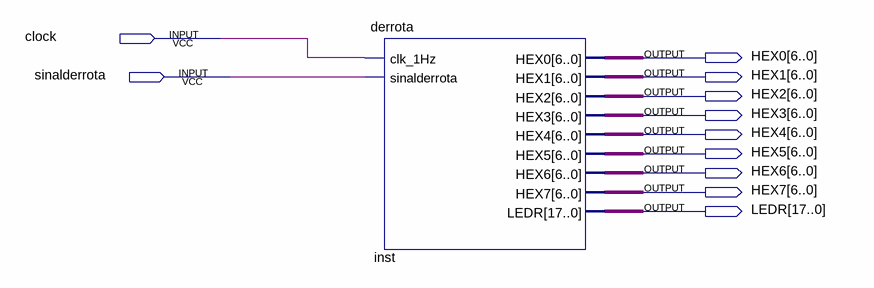
[diagram p0: schematic sheet]
// Quartus schematic esquematicotestederrota.bdf as structural Verilog: 1 symbols, 11 pins
module esquematicotestederrota (
  input  clock,
  input  sinalderrota,
  output [6:0] HEX0,
  output [6:0] HEX1,
  output [6:0] HEX2,
  output [6:0] HEX3,
  output [6:0] HEX4,
  output [6:0] HEX5,
  output [6:0] HEX6,
  output [6:0] HEX7,
  output [17:0] LEDR
);

  derrota inst (
    .clk_1Hz(clock), .sinalderrota(sinalderrota), .HEX0(HEX0), .HEX1(HEX1), .HEX2(HEX2), .HEX3(HEX3),
    .HEX4(HEX4), .HEX5(HEX5), .HEX6(HEX6), .HEX7(HEX7), .LEDR(LEDR));
endmodule
